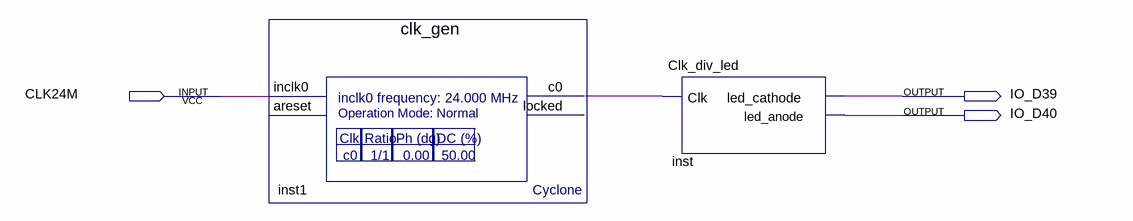
[diagram p0: schematic sheet]
// Quartus schematic cheap_test.bdf as structural Verilog: 2 symbols, 3 pins
module cheap_test (
  input  CLK24M,
  output IO_D39,
  output IO_D40
);

  wire inst1_c0;

  clk_gen inst1 (.inclk0(CLK24M), .c0(inst1_c0));  // open: areset, locked
  Clk_div_led inst (.Clk(inst1_c0), .led_cathode(IO_D39), .led_anode(IO_D40));
endmodule
